# EAGLE design ThruXtal (EAGLE 5.11)
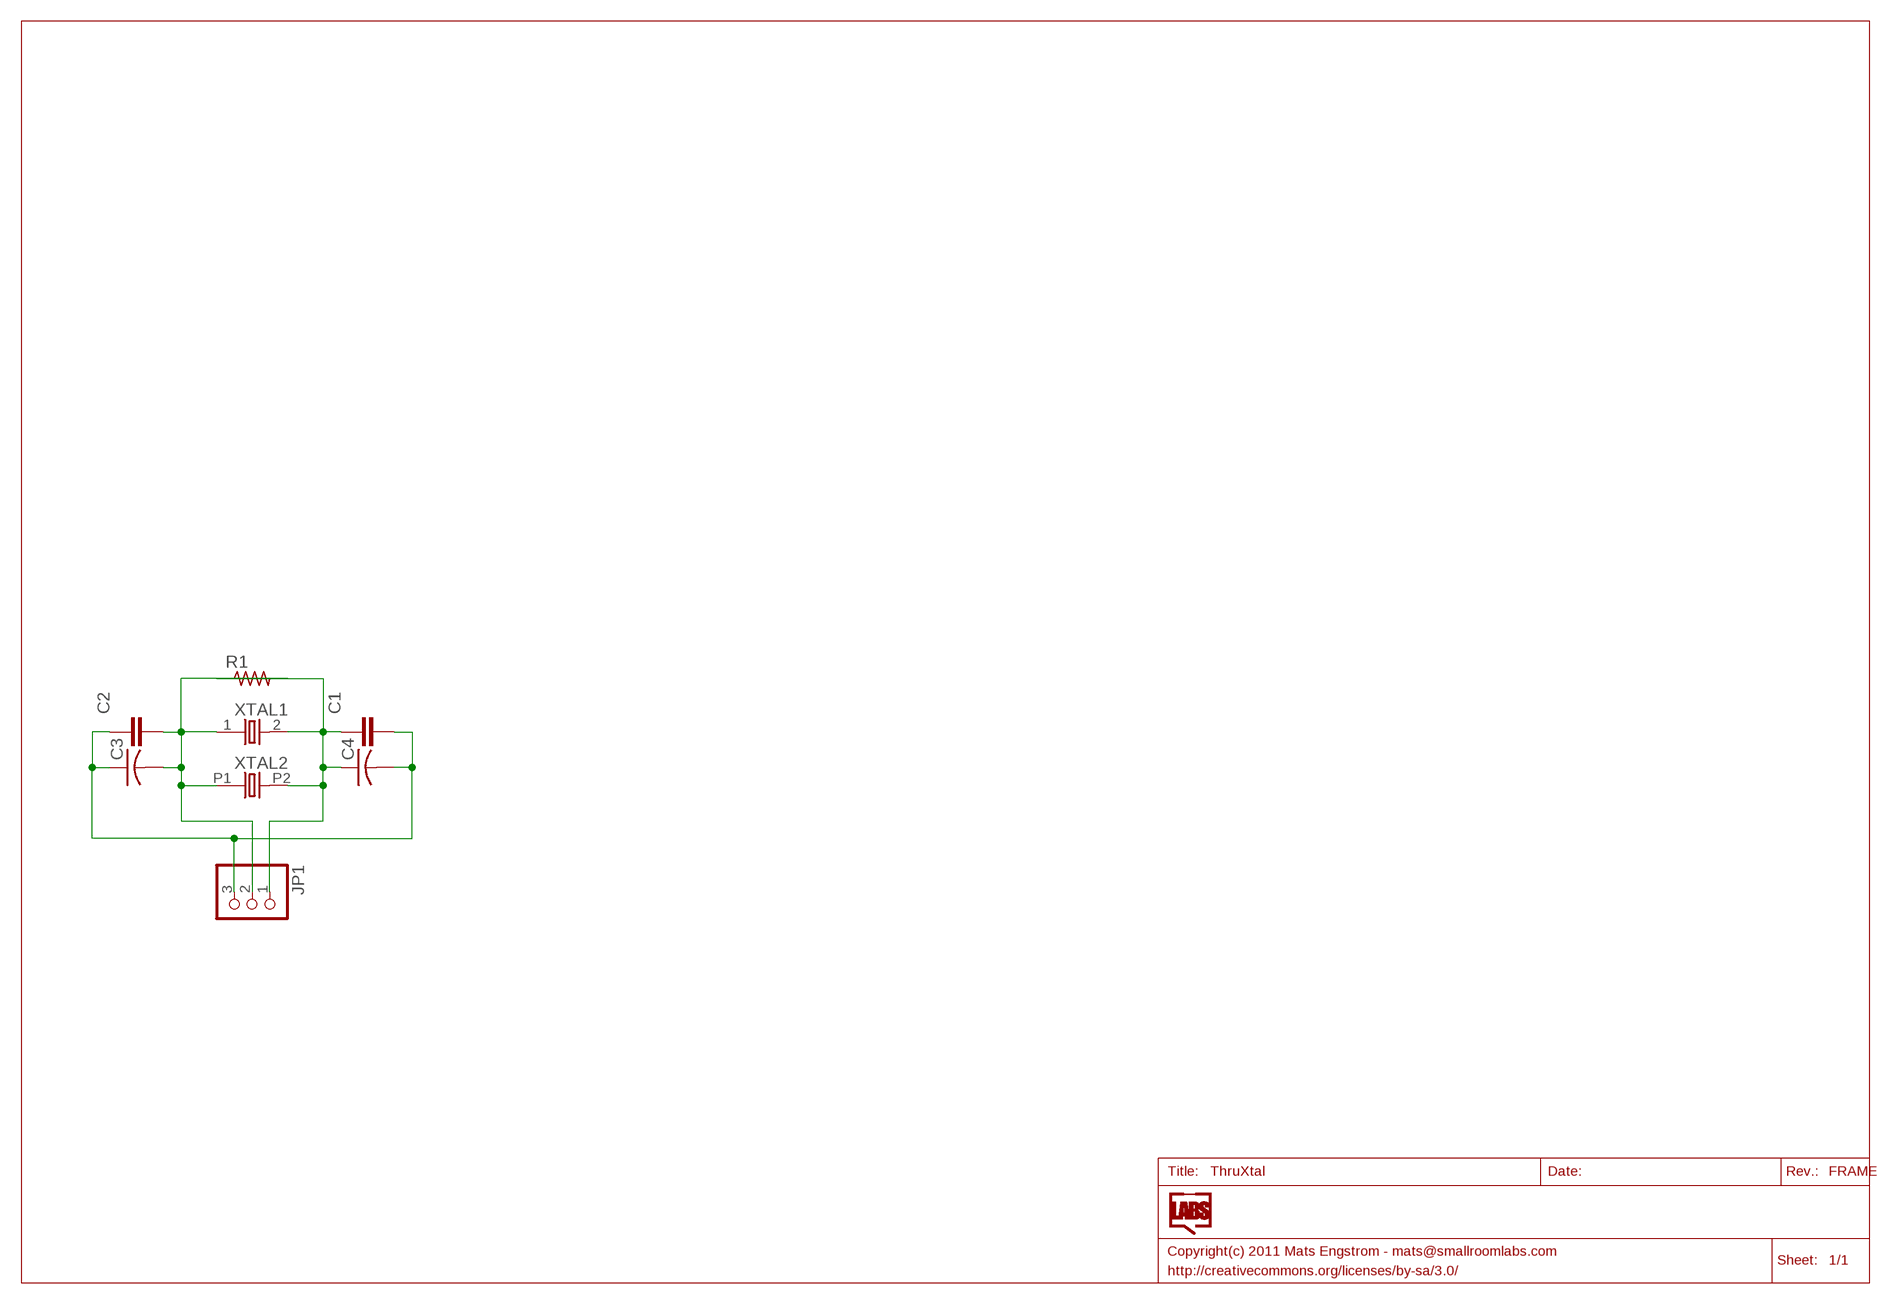
[diagram p0: schematic, sheet 1]

## Parts
C1  CAPACITOR_NPOL-PTH_0.1"  [C0.1PTH]
C2  CAPACITOR_NPOL-PTH_0.1"  [C0.1PTH]
C3  C-USC0805K  [C0805K]
C4  C-USC0805K  [C0805K]
JP1  PINHD-1X3  [1X03]
R1  R-US_0207/15  [0207/15]
XTAL1  OSC-XTAL-HC-49U-SMD  [HC-49U]
XTAL2  OSC-XTAL-HC-49U-PTH  [HC-49U-PTH]

## Nets
GND: C1.2 C2.1 C3.1 C4.2 JP1.3
XTAL1: C2.2 C3.2 JP1.2 R1.2 XTAL1.1 XTAL2.P1
XTAL2: C1.1 C4.1 JP1.1 R1.1 XTAL1.2 XTAL2.P2

## Library data of the parts
C1 C2 = dp_devices:CAPACITOR_NPOL: Non-Polarized capacitor in various packages
C3 C4 = adafruit:C-US: CAPACITOR, American symbol
JP1 = pinhead:PINHD-1X3: PIN HEADER
R1 = rcl:R-US_: RESISTOR, American symbol
XTAL1 XTAL2 = dp_devices:OSC-XTAL

## Board
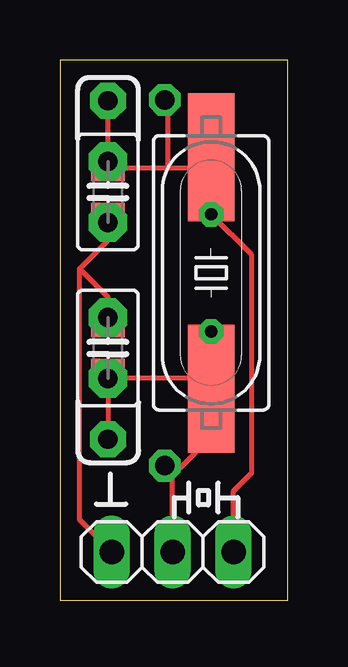
[diagram p1: board, top side]
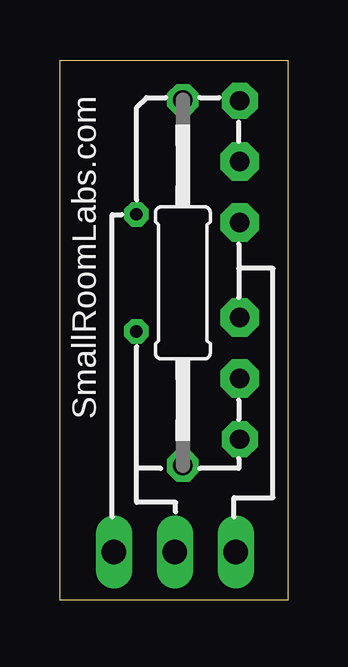
[diagram p2: board, bottom side, seen from below]

Size 9.5 x 22.5 mm. Coordinates in mm from the lower left corner, seen from the top.
Outline: 0,0 9.5,0 9.5,22.5 0,22.5 0,0
Copper layers (1*16): Top 0.035mm / dielectric 1.5mm / Bottom 0.035mm
Design rules "Fusion_eagle_rule_v1.1": minimum track width 6mil, minimum drill 12mil, track to track 6mil, track to pad 6mil, pad to pad 6mil, via to via 6mil, smd to smd 0mil, copper to edge 10mil, drill to drill 10mil, minimum pad ring 10mil, minimum via ring 6mil, stop-mask expansion 2mil, vias tented up to drill 100mil, thermal gap 10mil

### Footprints (pad centres in the part's own frame; a part is rotated, then mirrored left to right if it is on the bottom)
C0.1PTH = drill 0.813 pad 1.6 octagon: 1 -1.27,0; 2 1.27,0
C0805K = smd 1.1 x 1.4: 1 -1,0; 2 1,0
1X03 = drill 1.016 long: 1 -2.54,0; 2 0,0; 3 2.54,0
0207/15 = drill 0.813 octagon: 1 -7.62,0; 2 7.62,0
HC-49U = smd 5.334 x 1.93: 1 -4.826,0; 2 4.826,0
HC-49U-PTH = drill 0.508 octagon: P1 -2.44,0; P2 2.44,0

### Placement (x,y rotation side)
C1  2,17 270 top
C2  2,10.5 270 top
C3  2,10.5 270 top
C4  2,17 270 top
JP1  4.7,2 180 top
R1  4.37,13.22 270 bottom
XTAL1  6.31,13.63 90 top
XTAL2  6.31,13.63 90 top

### Tracks (layer width: path | path; a pad name or v marks a point on that pad's centre or on a via)
GND
  Top 0.203: JP1.3 0.81,3.35 0.81,13.8 | 0.81,13.8 2,14.99 C1.2 C4.2 | 0.81,13.8 2,12.61 C2.1 C3.1
XTAL1  (via drill 0.8 pad 1.5)
  Top 0.203: XTAL1.1 XTAL2.P1 | 5.5,9 5.7,8.8 XTAL1.1 | C2.2 v2,6.7 | JP1.2 4.7,5.6 R1.2 4.47,5.5 5,5.5 6.31,6.81 XTAL1.1 | C2.2 C3.2 | C2.2 6.31,9.23 XTAL1.1
XTAL2  (via drill 0.8 pad 1.5)
  Top 0.203: JP1.1 7.24,4.54 8,5.3 8,14.38 XTAL2.P2 6.31,18 | v2,20.8 C1.1 C4.1 4.5,18 | R1.1 4.5,20.84 4.5,18 | 6.31,18 4.5,18 | 6.31,18 XTAL1.2

### Text on the board
bPlace: SmallRoomLabs.com